# EAGLE design ideaboardv1b-new (EAGLE 7.6.0)
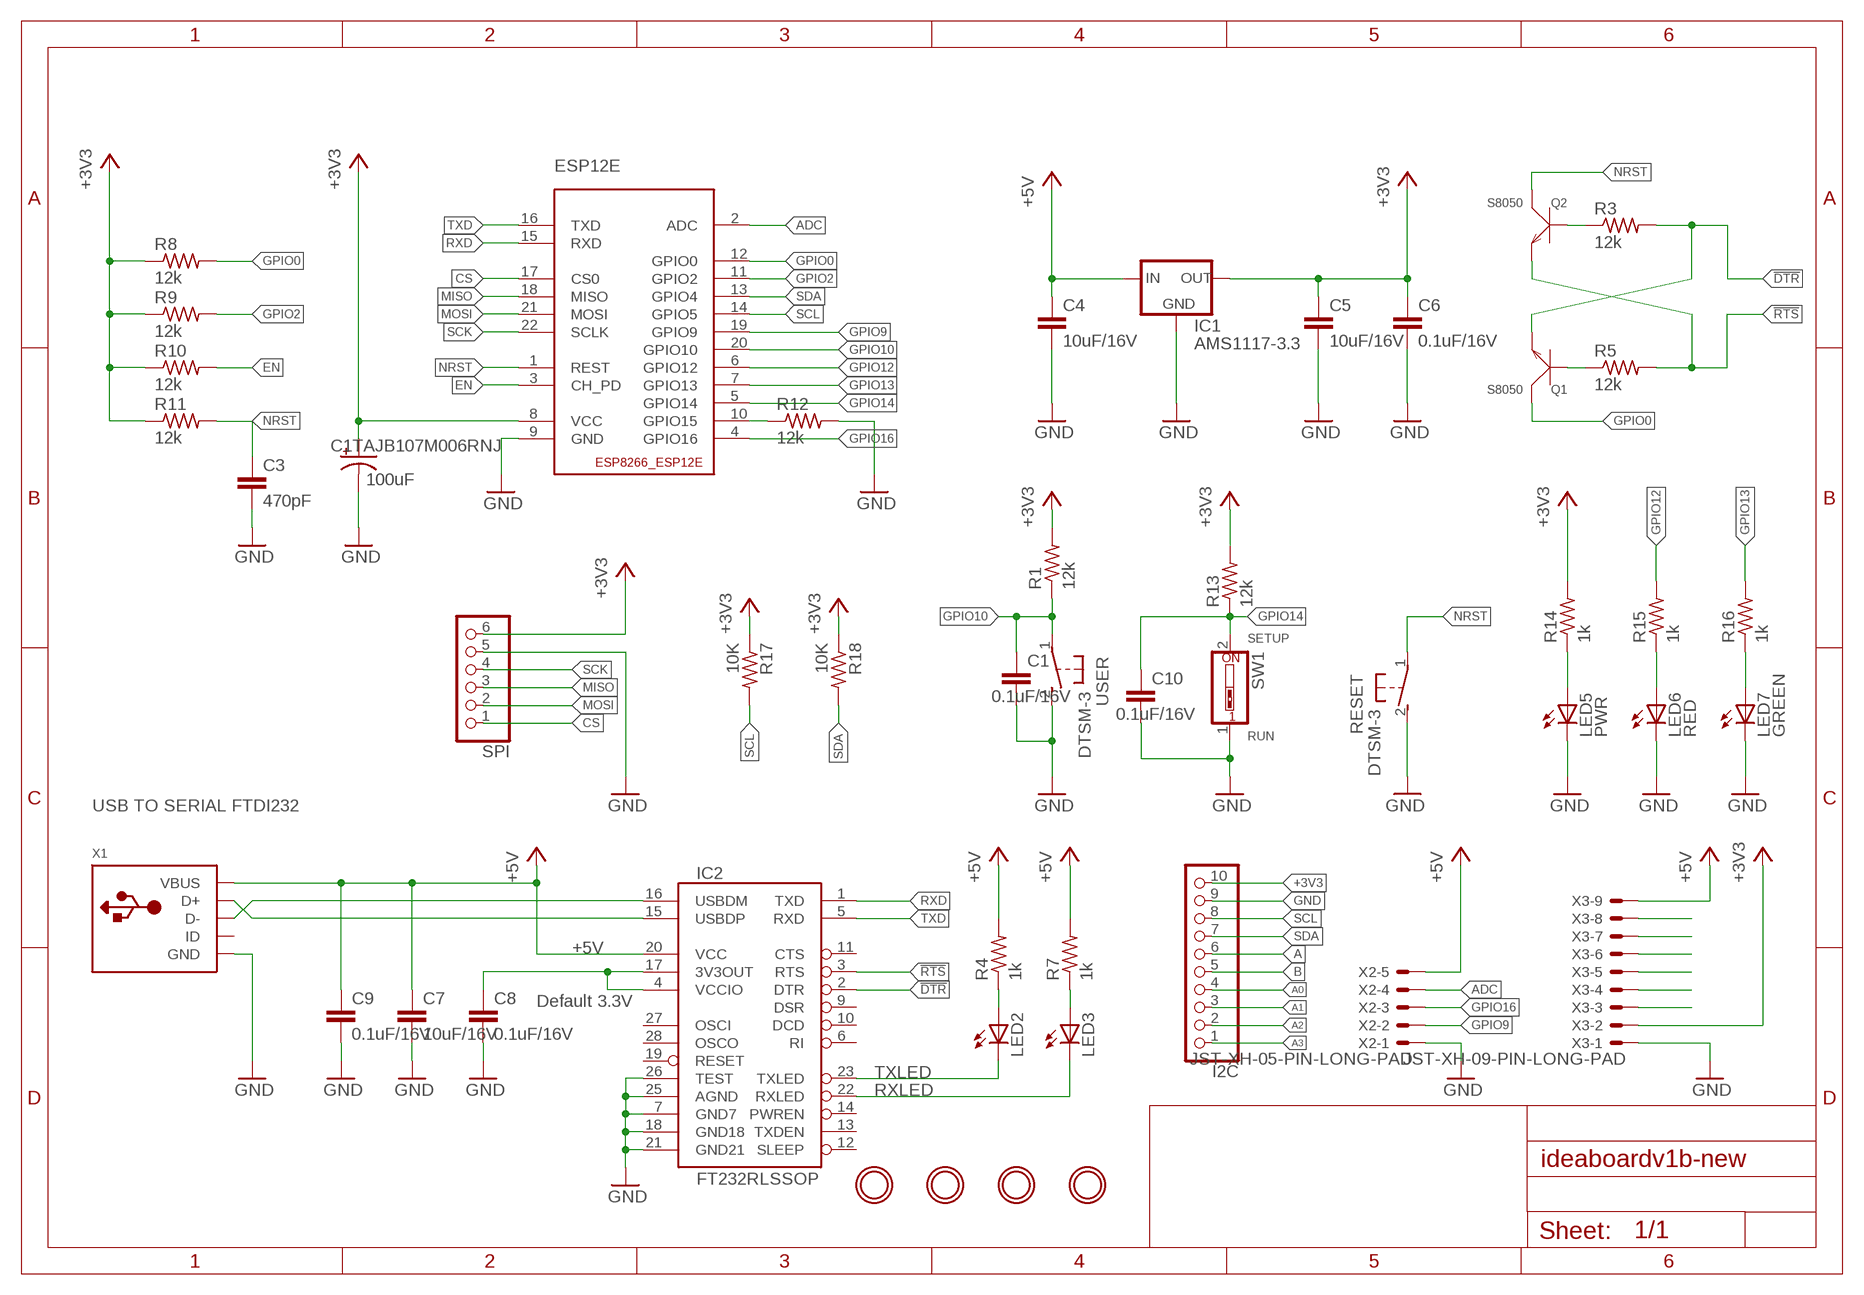
[diagram p0: schematic, sheet 1]

## Parts
C1  0.1uF/16V  C-EUC0805K  [C0805K]
C1TAJB107M006RNJ  100uF  CPOL-USA/3216-18R  [A/3216-18R]
C3  470pF  C-EUC0805K  [C0805K]
C4  10uF/16V  C-EUC0805K  [C0805K]
C5  10uF/16V  C-EUC0805K  [C0805K]
C6  0.1uF/16V  C-EUC0805K  [C0805K]
C7  10uF/16V  C-EUC0805K  [C0805K]
C8  0.1uF/16V  C-EUC0805K  [C0805K]
C9  0.1uF/16V  C-EUC0805K  [C0805K]
C10  0.1uF/16V  C-EUC0805K  [C0805K]
ESP12E  ESP8266-12EESP8266-ESP12E  [ESP8266-ESP12E]
I2C  PINHD-1X10  [1X10]
IC1  AMS1117-3.3  LM1117  [SOT223]
IC2  FT232RLSSOP  [SSOP28DB]
LED2  LEDCHIP-LED0805  [CHIP-LED0805]
LED3  LEDCHIP-LED0805  [CHIP-LED0805]
LED5  PWR  LEDCHIP-LED0805  [CHIP-LED0805]
LED6  RED  LEDCHIP-LED0805  [CHIP-LED0805]
LED7  GREEN  LEDCHIP-LED0805  [CHIP-LED0805]
Q1  S8050  SMD-TRANSISTORS-NPN-25V-500MW(SOT-23)  [SOT-23]
Q2  S8050  SMD-TRANSISTORS-NPN-25V-500MW(SOT-23)  [SOT-23]
R1  12k  R-US_M0805  [M0805]
R3  12k  R-US_M0805  [M0805]
R4  1k  R-US_M0805  [M0805]
R5  12k  R-US_M0805  [M0805]
R7  1k  R-US_M0805  [M0805]
R8  12k  R-US_M0805  [M0805]
R9  12k  R-US_M0805  [M0805]
R10  12k  R-US_M0805  [M0805]
R11  12k  R-US_M0805  [M0805]
R12  12k  R-US_M0805  [M0805]
R13  12k  R-US_M0805  [M0805]
R14  1k  R-US_M0805  [M0805]
R15  1k  R-US_M0805  [M0805]
R16  1k  R-US_M0805  [M0805]
R17  10K  R-US_M0805  [M0805]
R18  10K  R-US_M0805  [M0805]
RESET  DTSM-3  [DTSM-3]
SPI  PINHD-1X6  [1X06]
SW1  SW_DIP-1  [EDG-01]
U$1  MOUNTINGHOLE2.0  [MOUNTINGHOLE_2.0_PLATED]
U$2  MOUNTINGHOLE2.0  [MOUNTINGHOLE_2.0_PLATED]
U$3  MOUNTINGHOLE2.0  [MOUNTINGHOLE_2.0_PLATED]
U$4  MOUNTINGHOLE2.0  [MOUNTINGHOLE_2.0_PLATED]
USER  DTSM-3  [DTSM-3]
X1  USB_MICRO_20329_V2  [4UCONN_20329_V2]
X2  JST-XH-05-PIN-LONG-PAD  [JST-XH-05-PACKAGE-LONG-PAD]
X3  JST-XH-09-PIN-LONG-PAD  [JST-XH-09-PACKAGE-LONG-PAD]

## Nets
!DTR: IC2.2(DTR) Q1.2(E) R3.2
!RTS: IC2.3(RTS) Q2.2(E) R5.2
+3V3: C1TAJB107M006RNJ.+ C5.1 C6.1 ESP12E.8(VCC) I2C.10 IC1.2(OUT) R1.2 R8.1 R9.1 R10.1 R11.1 R13.2 R14.2 R17.1 R18.1 SPI.6 X3.2
+5V: C4.1 C7.1 C9.1 IC1.3(IN) IC2.20(VCC) R4.2 R7.2 X1.VBUS X2.5 X3.9
A: I2C.6 X3.3
A0: I2C.4 X3.5
A1: I2C.3 X3.6
A2: I2C.2 X3.7
A3: I2C.1 X3.8
ADC: ESP12E.2(ADC) X2.4
B: I2C.5 X3.4
CS: ESP12E.17(CS0) SPI.1
EN: ESP12E.3(CH_PD) R10.2
GND: C1.2 C1TAJB107M006RNJ.- C3.2 C4.2 C5.2 C6.2 C7.2 C8.2 C9.2 C10.2 ESP12E.9(GND) I2C.9 IC1.1(GND) IC2.7(GND7) IC2.18(GND18) IC2.21(GND21) IC2.25(AGND) IC2.26(TEST) LED5.C LED6.C LED7.C R12.2 RESET.2 SPI.5 SW1.1 USER.2 X1.BASE@1(GND) X1.BASE@2(GND) X1.GND X1.SPRT@1(GND) X1.SPRT@2(GND) X1.SPRT@3(GND) X1.SPRT@4(GND) X2.1 X3.1
GPIO0: ESP12E.12(GPIO0) Q1.3(C) R8.2
GPIO2: ESP12E.11(GPIO2) R9.2
GPIO9: ESP12E.19(GPIO9) X2.2
GPIO10: C1.1 ESP12E.20(GPIO10) R1.1 USER.1
GPIO12: ESP12E.6(GPIO12) R15.2
GPIO13: ESP12E.7(GPIO13) R16.2
GPIO14: C10.1 ESP12E.5(GPIO14) R13.1 SW1.2
GPIO16: ESP12E.4(GPIO16) X2.3
MISO: ESP12E.18(MISO) SPI.3
MOSI: ESP12E.21(MOSI) SPI.2
N$1: Q2.1(B) R3.1
N$2: Q1.1(B) R5.1
N$3: ESP12E.10(GPIO15) R12.1
N$5: C8.1 IC2.4(VCCIO) IC2.17(3V3OUT)
N$8: LED5.A R14.1
N$9: LED2.A R4.1
N$10: LED6.A R15.1
N$11: LED3.A R7.1
N$12: LED7.A R16.1
NRST: C3.1 ESP12E.1(REST) Q2.3(C) R11.2 RESET.1
RXD: ESP12E.15(RXD) IC2.1(TXD)
RXLED: IC2.22(RXLED) LED3.C
SCK: ESP12E.22(SCLK) SPI.4
SCL: ESP12E.14(GPIO5) I2C.8 R17.2
SDA: ESP12E.13(GPIO4) I2C.7 R18.2
TXD: ESP12E.16(TXD) IC2.5(RXD)
TXLED: IC2.23(TXLED) LED2.C
USB_D+: IC2.15(USBDP) X1.D+
USB_D-: IC2.16(USBDM) X1.D-
Unconnected: IC2.6(RI) IC2.9(DSR) IC2.10(DCD) IC2.11(CTS) IC2.12(SLEEP) IC2.13(TXDEN) IC2.14(PWREN) IC2.19(RESET) IC2.27(OSCI) IC2.28(OSCO) X1.ID

## Notes on the sheet
- SETUP
- RUN
- USB TO SERIAL FTDI232
- Default 3.3V

## Library data of the parts
C1 C3-C10 = rcl:C-EU: CAPACITOR, European symbol
C1TAJB107M006RNJ = rcl:CPOL-US: POLARIZED CAPACITOR, American symbol
ESP12E = ESP8266-ESP12E:ESP8266-12E: ESP8266-12E with additional I/O and GPIO04/05 corrected The author cannot warrant that this library is free from error or will meet your specific requirements. Created by PuceBaboon.com. Komagane, Nagano, JAPAN
I2C = pinhead:PINHD-1X10: PIN HEADER
IC1 = v-reg-3:LM1117
IC2 = FTDI Basic-v21-5V:FT232RL: USB UART FT232RL 4th Generation USB UART (USB <-> Serial) Controller. Spark Fun Electronics SKU : COM-00650
LED2 LED3 LED5-LED7 = led:LED: LED OSRAM: - CHIPLED LG R971, LG N971, LY N971, LG Q971, LY Q971, LO R971, LY R971 LH N974, LH R974 LS Q976, LO Q976, LY Q976 LO Q996 - Hyper CHIPLED LW Q18S LB Q993, LB Q99A, LB R99A - SideLED LS A670, LO A670, LY A670, LG A670, LP A670 LB A673, LV A673, LT A673, LW A673 LH A674 LY A675 LS A676, LA A676, LO A676, LY A676, LW A676 LS A679, LY A679, LG A679 - Hyper Micro SIDELED® LS Y876, LA Y876, LO Y876, LY Y876 LT Y87S - SmartLED LW L88C, LW L88S LB L89C, LB L89S, LG L890 LS L89K, LO L89K, LY L89K LS L896, LA L896, LO L896, LY L896 - TOPLED LS T670, LO T670, LY T670, LG T670, LP T670 LSG T670, LSP T670, LSY T670, LOP T670, LYG T670 LG T671, LOG T671, LSG T671 LB T673, LV T673, LT T673, LW T673 LH T674 LS T676, LA T676, LO T676, LY T676, LB T676, LH T676, LSB T676, LW T676 LB T67C, LV T67C, LT T67C, LS T67K, LO T67K, LY T67K, LW E67C LS E67B, LA E67B, LO E67B, LY E67B, LB E67C, LV E67C, LT E67C LW T67C LS T679, LY T679, LG T679 LS T770, LO T770, LY T770, LG T770, LP T770 LB T773, LV T773, LT T773, LW T773 LH T774 LS E675, LA E675, LY E675, LS T675 LS T776, LA T776, LO T776, LY T776, LB T776 LHGB T686 LT T68C, LB T68C - Hyper Mini TOPLED® LB M676 - Mini TOPLED Santana® LG M470 LS M47K, LO M47K, LY M47K Source: http://www.osram.convergy.de LUXEON: - LUMILED® LXK2-PW12-R00, LXK2-PW12-S00, LXK2-PW14-U00, LXK2-PW14-V00 LXK2-PM12-R00, LXK2-PM12-S00, LXK2-PM14-U00 LXK2-PE12-Q00, LXK2-PE12-R00, LXK2-PE12-S00, LXK2-PE14-T00, LXK2-PE14-U00 LXK2-PB12-K00, LXK2-PB12-L00, LXK2-PB12-M00, LXK2-PB14-N00, LXK2-PB14-P00, LXK2-PB14-Q00 LXK2-PR12-L00, LXK2-PR12-M00, LXK2-PR14-Q00, LXK2-PR14-R00 LXK2-PD12-Q00, LXK2-PD12-R00, LXK2-PD12-S00 LXK2-PH12-R00, LXK2-PH12-S00 LXK2-PL12-P00, LXK2-PL12-Q00, LXK2-PL12-R00 Source: www.luxeon.com KINGBRIGHT: KA-3528ASYC Source: www.kingbright.com
Q1 Q2 = s8050-transistor:SMD-TRANSISTORS-NPN-25V-500MW(SOT-23): 305010017; AVAILABILITY: Unavailable; DESCRIPTION: SMD Transistors NPN 25V-500mW%3B; MF: JCET; MP: S8050; PACKAGE: SOT-23-3 JCET; PRICE: None
R1 R3-R5 R7-R18 = rcl:R-US_: RESISTOR, American symbol
RESET USER = switch-tact:DTSM-3
SPI = pinhead:PINHD-1X6: PIN HEADER
SW1 = special:SW_DIP-1: DIP SWITCH
U$1-U$4 = Adafruit SIM808 Breakout:MOUNTINGHOLE: Mounting Hole For #2 screws (0.086"/2.18mm width, 0.094"/2.4mm hole) use 2.5mm; BOM: EXCLUDE
X1 = Adafruit SIM808 Breakout:USB: USB Connectors USBMINIB - Surface Mount Female Mini-B USB Connector 4UConnector: 06564
X2 = Rembrandt Electronics - JST XH Connectors v1-0:JST-XH-05-PIN: JST XH Connector 2 Pin Wire to board connector. Pitch: 2,54 mm, (0.100") Number of pins: 5 Created by Rembrandt Electronics www.rembrandtelectronics.com
X3 = Rembrandt Electronics - JST XH Connectors v1-0:JST-XH-09-PIN: JST XH Connector 2 Pin Wire to board connector. Pitch: 2,54 mm, (0.100") Number of pins: 9 Created by Rembrandt Electronics www.rembrandtelectronics.com

## Net classes
0 default: width 0.203 mm, drill 0.356 mm, clearance 0.203 mm
1 power: width 0.305 mm, drill 0.356 mm, clearance 0.203 mm

## Board
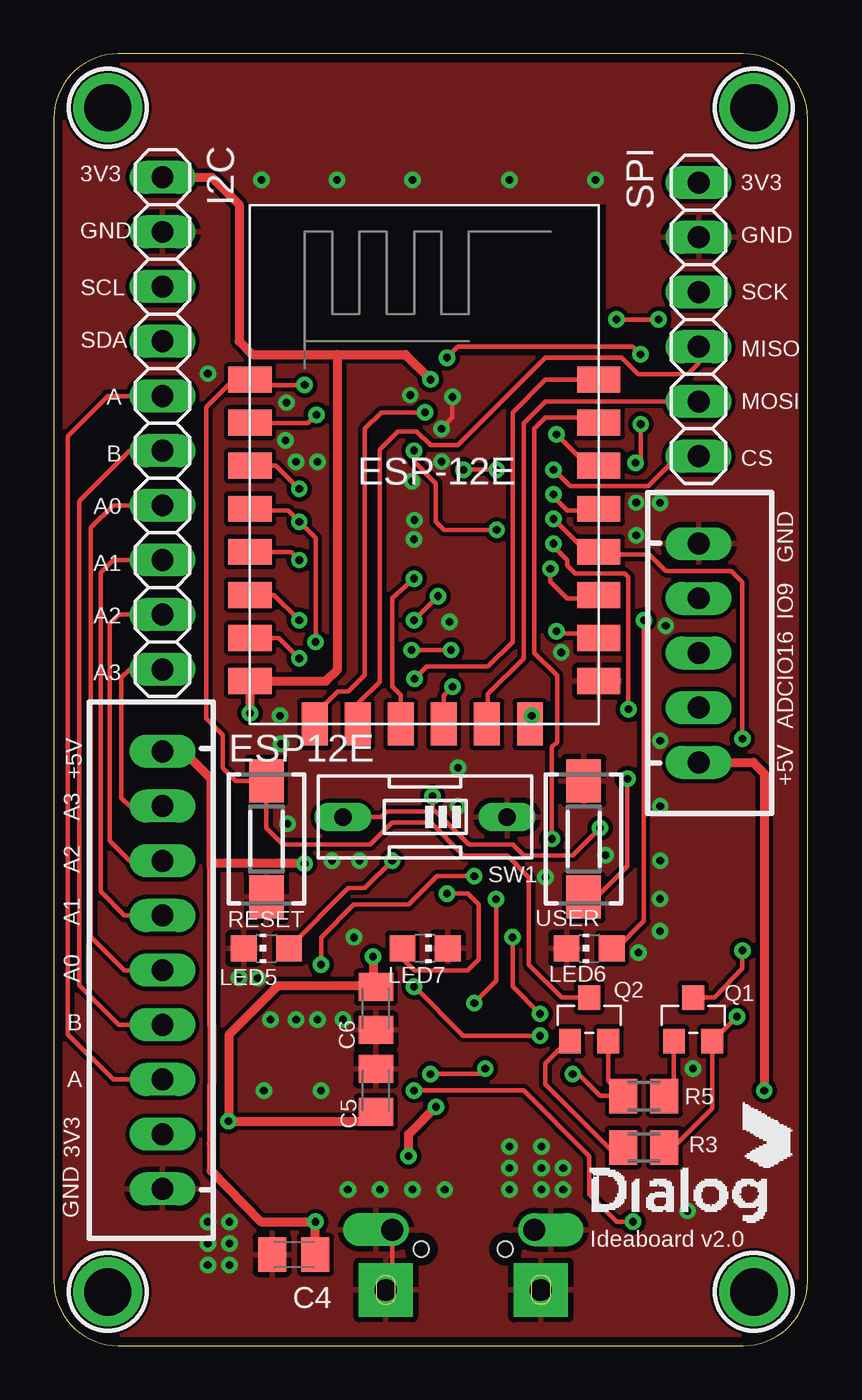
[diagram p1: board, top side]
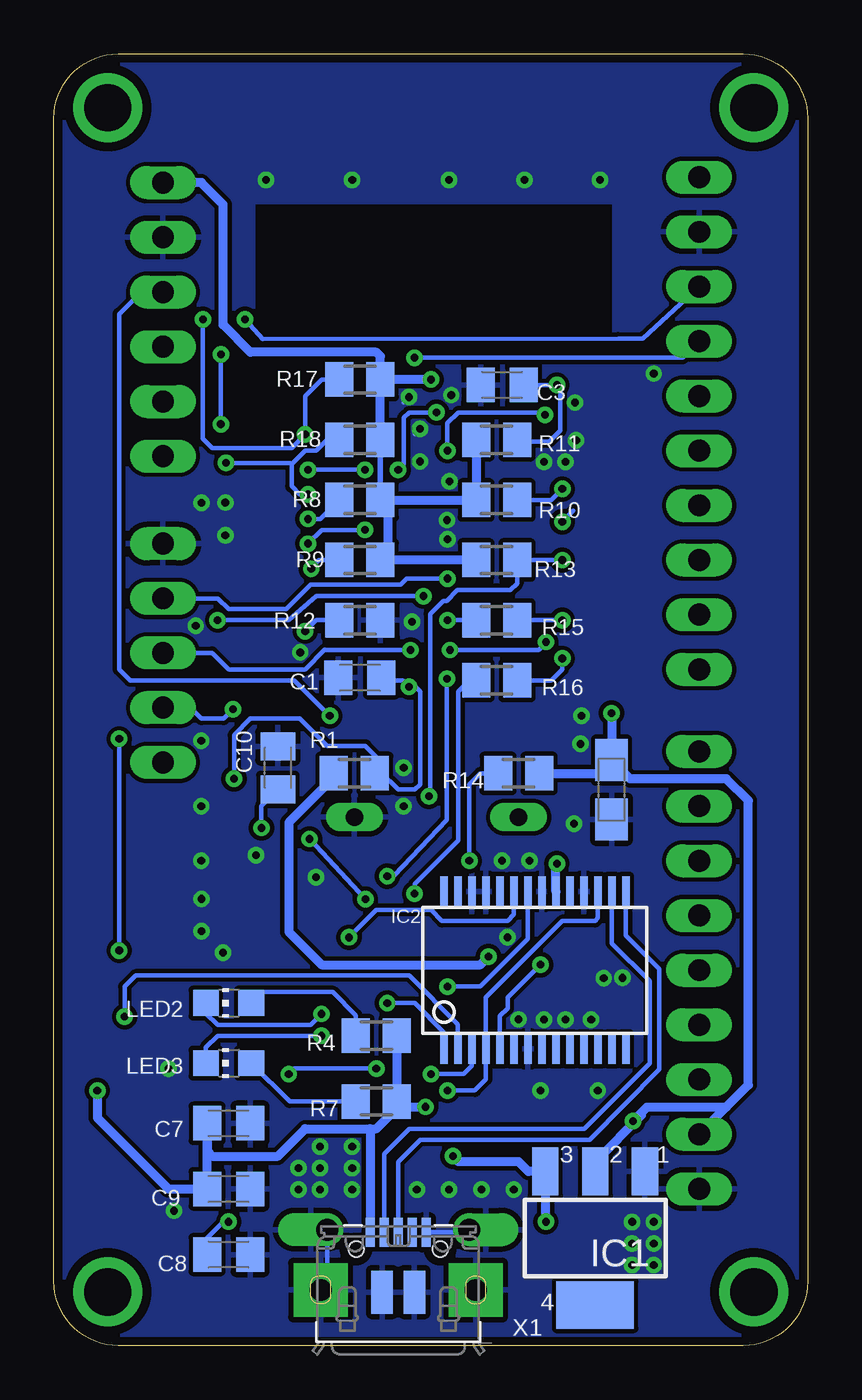
[diagram p2: board, bottom side, seen from below]

Size 35 x 60 mm. Coordinates in mm from the lower left corner, seen from the top.
Outline: 3,0 32,0 arc90 35,3 35,57 arc90 32,60 3,60 arc90 0,57 0,3 arc90 3,0
Copper layers (1*16): Top 0.035mm / dielectric 1.5mm / Bottom 0.035mm
Design rules "default *": minimum track width 8mil, minimum drill 14mil, track to track 6mil, track to pad 6mil, pad to pad 6mil, via to via 6mil, smd to smd 6mil, copper to edge 16mil, drill to drill 8mil, minimum pad ring 10mil, minimum via ring 8mil, stop-mask expansion 4mil, vias tented up to drill 0mil, thermal gap 10mil

### Footprints (pad centres in the part's own frame; a part is rotated, then mirrored left to right if it is on the bottom)
C0805K = smd 1.3 x 1.6: 1 -1,0; 2 1,0
A/3216-18R = smd 1.95 x 1.5: + 1.375,0; - -1.375,0
ESP8266-ESP12E = smd 2 x 1.2: 1 -7.62,5.84; 2 -7.62,3.84; 3 -7.62,1.84; 4 -7.62,-0.16; 5 -7.62,-2.16; 6 -7.62,-4.16; 7 -7.62,-6.16; 8 -7.62,-8.16; 9 8.58,-8.16; 10 8.58,-6.16; 11 8.58,-4.16; 12 8.58,-2.16; 13 8.58,-0.16; 14 8.58,1.84; 15 8.58,3.84; 16 8.58,5.84 | smd 1.2 x 2: 17 -4.62,-10.16; 18 -2.62,-10.16; 19 -0.62,-10.16; 20 1.38,-10.16; 21 3.38,-10.16; 22 5.38,-10.16
1X10 = drill 1.016 long: 1 -11.43,0; 2 -8.89,0; 3 -6.35,0; 4 -3.81,0; 5 -1.27,0; 6 1.27,0; 7 3.81,0; 8 6.35,0; 9 8.89,0; 10 11.43,0
SOT223 = smd 1.219 x 2.235: 1 -2.311,-3.099; 2 0,-3.099; 3 2.311,-3.099 | smd 3.6 x 2.2: 4 0,3.099
SSOP28DB = smd 0.348 x 1.397: 1 -4.225,-3.656; 2 -3.575,-3.656; 3 -2.925,-3.656; 4 -2.275,-3.656; 5 -1.625,-3.656; 6 -0.975,-3.656; 7 -0.325,-3.656; 8 0.325,-3.656; 9 0.975,-3.656; 10 1.625,-3.656; 11 2.275,-3.656; 12 2.925,-3.656; 13 3.575,-3.656; 14 4.225,-3.656; 15 4.225,3.656; 16 3.575,3.656; 17 2.925,3.656; 18 2.275,3.656; 19 1.625,3.656; 20 0.975,3.656; 21 0.325,3.656; 22 -0.325,3.656; 23 -0.975,3.656; 24 -1.625,3.656; 25 -2.275,3.656; 26 -2.925,3.656; 27 -3.575,3.656; 28 -4.225,3.656
CHIP-LED0805 = smd 1.2 x 1.2: A 0,-1.05; C 0,1.05
SOT-23 = smd 1.016 x 1.143: 1 -0.889,-1.016; 2 0.889,-1.016; 3 0,1.016
M0805 = smd 1.3 x 1.6: 1 -0.95,0; 2 0.95,0
DTSM-3 = smd 2 x 1.6: 1 -2.7,0; 2 2.7,0
1X06 = drill 1.016 long: 1 -6.35,0; 2 -3.81,0; 3 -1.27,0; 4 1.27,0; 5 3.81,0; 6 6.35,0
EDG-01 = drill 0.813 long: 1 0,-3.81; 2 0,3.81
MOUNTINGHOLE_2.0_PLATED = drill 2.2 pad 3: P$1 0,0
4UCONN_20329_V2 = smd 1 x 2: BASE@1 -0.75,-2; BASE@2 0.75,-2 | smd 0.4 x 1.35: D+ 0,0.775; D- -0.65,0.775; GND 1.3,0.775; ID 0.65,0.775; VBUS -1.3,0.775 | drill 1.016 pad 1.454 offset: SPRT@1 -3.3,0.9; SPRT@2 3.3,0.9 | drill 1.016 pad 2.5 square: SPRT@3 -3.6,-1.9; SPRT@4 3.6,-1.9 | hole 0.7: -1.95,0; 1.95,0
JST-XH-05-PACKAGE-LONG-PAD = drill 1.016 long: 1 -5.08,0; 2 -2.54,0; 3 0,0; 4 2.54,0; 5 5.08,0
JST-XH-09-PACKAGE-LONG-PAD = drill 1.016 long: 1 -10.16,0; 2 -7.62,0; 3 -5.08,0; 4 -2.54,0; 5 0,0; 6 2.54,0; 7 5.08,0; 8 7.62,0; 9 10.16,0

### Placement (x,y rotation side)
C1  20.79,31.03 180 bottom
C1TAJB107M006RNJ  9.11,25.82 90 bottom
C3  14.19,44.62 180 bottom
C4  11.14,4.23 180 top
C5  14.95,11.85 90 top
C6  14.95,15.66 270 top
C7  26.89,10.33 0 bottom
C8  26.89,4.23 0 bottom
C9  26.89,7.28 0 bottom
C10  24.6,26.84 90 bottom
ESP12E  16.73,39.03 0 top
I2C  5.04,42.84 90 top
IC1  9.87,4.99 180 bottom
IC2  12.66,17.44 0 bottom
LED2  26.89,15.92 90 bottom
LED3  26.89,13.12 90 bottom
LED5  9.87,18.46 90 top
LED6  24.85,18.46 90 top
LED7  17.23,18.46 270 top
Q1  29.68,15.15 0 top
Q2  24.85,15.15 0 top
R1  21.04,26.58 180 bottom
R3  27.39,9.21 0 top
R4  20.03,14.39 0 bottom
R5  27.39,11.6 180 top
R7  20.03,11.34 0 bottom
R8  20.79,39.28 180 bottom
R9  20.79,36.49 180 bottom
R10  14.44,39.28 0 bottom
R11  14.44,42.08 0 bottom
R12  20.79,33.7 0 bottom
R13  14.44,36.49 180 bottom
R14  13.42,26.58 0 bottom
R15  14.44,33.7 0 bottom
R16  14.44,30.9 0 bottom
R17  20.79,44.87 180 bottom
R18  20.79,42.08 180 bottom
RESET  9.87,23.54 270 top
SPI  29.93,47.67 90 top
SW1  17.23,24.55 90 top
U$1  2.5,2.5 0 top
U$2  32.5,2.5 0 top
U$3  2.5,57.5 0 top
U$4  32.5,57.5 0 top
USER  24.6,23.54 90 top
X1  19.01,4.49 0 bottom
X2  29.93,32.17 270 top
X3  5.04,17.44 90 top

### Tracks (layer width: path | path; a pad name or v marks a point on that pad's centre or on a via)
!DTR  (via drill 0.36 pad 0.76)
  Top 0.203: v31.71,15.28 Q1.2 30.57,11.03 28.75,9.21 R3.2
  Bottom 0.203: IC2.2 16.24,14.92 18.5,17.19 31.2,17.19 31.71,16.68 v31.71,15.28
!RTS  (via drill 0.36 pad 0.76)
  Top 0.203: Q2.2 25.74,12.3 R5.2 25.36,11.6 24.35,12.61 v24.09,12.61 | v17.49,12.61 19.77,12.61 v20.03,12.87
  Bottom 0.203: IC2.3 15.59,12.99 15.96,12.61 v17.49,12.61 | v20.03,12.87 23.84,12.87 v24.09,12.61
+3V3  (via drill 0.36 pad 0.76)
  Top 0.203: 14.82,16.79 14.88,16.73 C6.1
  Top 0.406: 14.88,16.73 10.43,16.73 8.13,14.43 8.13,13.66 v8.12,10.43 14.53,10.43 C5.1 | I2C.10 7.33,54.27 8.6,53 8.6,46.65 9.21,46.04 13.17,46.04 | 13.17,46.04 16.32,46.04 v17.49,44.87 | v9.11,29.38 ESP12E.8 12.63,30.87 13.17,31.41 13.17,46.04 | v14.82,18.08 14.82,16.79
  Bottom 0.203: R10.1 R11.1 | 15.39,39.35 15.46,39.28 R8.1 | IC1.2 9.87,8.55 | v8.12,10.43 7.71,10.71 | 21.74,26.4 21.99,26.4
  Bottom 0.254: R18.1 R8.1
  Bottom 0.406: v17.49,44.87 R17.1 | R17.1 19.84,45.95 20.03,46.14 25.87,46.14 27.14,47.41 27.14,53 28.16,54.02 SPI.6 | v9.11,29.38 C1TAJB107M006RNJ.+ | R14.2 9.72,26.58 C1TAJB107M006RNJ.+ | R11.1 15.39,39.35 | R1.2 21.74,26.4 | 9.87,8.55 7.71,10.71 | 3.77,11.09 7.46,11.09 v8.12,10.43 | 3.77,11.09 2.76,12.11 2.76,25.31 3.77,26.33 8.24,26.33 C1TAJB107M006RNJ.+ | 3.77,11.09 X3.2 | R13.2 R9.1 19.51,36.82 19.51,38.81 19.84,39.14 R8.1 15.71,39.28 15.46,39.03 | R18.1 R17.1 | 21.99,26.4 24.09,24.3 24.09,19.22 22.57,17.69 15.2,17.69 v14.82,18.08
+5V  (via drill 0.36 pad 0.76)
  Top 0.203: 7.43,22.39 7.3,22.27 | 12.14,5.74 v12.15,5.76
  Top 0.406: v11.65,22.39 7.43,22.39 | C4.1 12.14,5.74 | v16.47,8.8 16.47,9.82 v17.74,11.09 | v12.15,5.76 9.61,5.76 7.3,8.12 7.3,9.39 7.33,14.9 7.33,22.24 7.3,22.27 7.3,26.33 6.03,27.6 X3.9 | X2.5 32.47,27.09 32.98,26.58 v32.98,11.85
  Bottom 0.203: 19.27,10.84 19.27,11.16 R7.2 R4.2 19.08,11.41 19.01,11.34 | 19.08,11.16 19.01,11.09 | 11.69,22.35 v11.65,22.39 | 12.15,8.07 IC1.3
  Bottom 0.406: 19.27,10.84 20.03,10.07 20.31,10.07 | 20.31,10.07 23.33,10.07 24.6,8.8 27.65,8.8 27.89,9.04 C7.1 C9.1 29.68,7.28 32.98,10.58 v32.98,11.85 | R4.2 19.08,11.16 | 19.01,11.09 v17.74,11.09 | IC2.20 11.69,22.35 | 20.31,10.07 X1.VBUS | v12.15,5.76 12.15,8.07 | IC1.3 12.97,8.09 13.42,8.55 16.22,8.55 v16.47,8.8
A
  Top 0.203: I2C.6 2.5,44.11 0.65,42.26 0.65,14.47 2.76,12.36 X3.3
A0
  Top 0.203: I2C.4 2.76,39.03 1.71,37.99 1.71,18.99 3.26,17.44 X3.5
A1
  Top 0.203: I2C.3 2.76,36.49 2.17,35.91 2.17,21.1 3.26,19.98 X3.6
A2
  Top 0.203: I2C.2 3.01,33.95 2.6,33.54 2.6,23.43 3.52,22.52 X3.7
A3
  Top 0.203: X3.8 3.52,25.06 3.14,25.44 3.14,31.03 3.52,31.41 I2C.1
ADC  (via drill 0.36 pad 0.76)
  Top 0.203: ESP12E.2 9.14,42.84 11.79,42.84 v12.19,43.24 | v20.56,37.89 18.12,37.89 17.74,38.27 17.74,40.05 16.73,41.06 v16.73,41.57 | v23.2,37.25 23.2,37.12 23.84,36.49 23.84,36.24 24.22,35.85 26.51,35.85 26.67,35.69 26.67,29.57 v26.68,29.56
  Bottom 0.203: X2.4 28.66,29.63 28.16,29.12 27.11,29.12 v26.68,29.56 | v20.56,37.89 22.57,37.89 v23.2,37.25 | v16.73,41.57 16.73,42.84 16.22,43.35 12.3,43.35 v12.19,43.24
B
  Top 0.203: I2C.5 3.52,41.57 1.18,39.23 1.18,16.73 3.01,14.9 X3.4
CS  (via drill 0.36 pad 0.76)
  Top 0.203: SPI.1 29,41.32 27.6,39.92 23.97,39.92 v23.2,40.68 | ESP12E.17 12.11,29.33 13.17,30.39 13.68,30.39 14.44,31.16 14.44,42.59 15.2,43.35 v17.23,43.35 | v20.56,40.68 v19.01,40.68
  Bottom 0.203: v17.23,43.35 18.5,43.35 18.76,43.09 18.76,40.93 v19.01,40.68 | v23.2,40.68 v20.56,40.68
EN  (via drill 0.36 pad 0.76)
  Top 0.203: ESP12E.3 10.31,40.87 v11.39,39.79
  Bottom 0.203: v11.39,39.79 11.9,39.28 R10.2
GND  (via drill 0.36 pad 0.76)
  Top 0.203: X1.SPRT@2 15.71,2.89 X1.SPRT@4 | v18.5,44.06 18.5,43.09 v18,42.59
  Bottom 0.203: X1.GND 15.84,5.26 X1.SPRT@2 | X1.SPRT@1 22.31,2.89 X1.SPRT@3 | 18.76,43.8 v18.5,44.06 | v18,42.59 18.25,42.33
  other vias: 13.42,15.15 12.92,22.52 14.19,22.52 13.93,18.96 16.62,40.15 18,41.06 18.38,33.62 23.56,32.2 12.41,11.85 27.04,39.16 27.04,37.64 28.15,39.15 22.82,21.76 28.16,22.52 28.16,25.06 28.16,28.1 8.6,17.08 29.43,6.26 29.68,12.87 28.41,33.44 18.76,25.06 16.73,37.46 25.62,22.77 18.76,26.84 10.5,29.25 9.65,54.15 25.15,54.15 21.15,54.15 16.65,54.15 13.15,54.15 7.15,45.15 10.8,43.8 10.75,42.05 12.25,41.05 11.25,41.05 16.55,44.15 16.75,38.35 10.55,27.95 10.85,24.25 28.15,20.75 28.15,19.25 27.15,18.25 13.65,7.25 15.15,7.25 16.65,7.25 18.15,7.25 21.15,9.25 22.65,9.25 23.65,8.25 21.15,8.25 21.15,7.25 22.65,7.25 22.65,8.25 23.65,7.25 7.15,3.75 8.15,3.75 8.15,4.75 8.15,5.75 7.15,5.75 7.15,4.75 9.47,17.07 12.25,15.15 11.25,15.15 10.05,15.15 9.75,11.85
  pour Top: 0.02,60 35,60 35,0 0,0
  pour Bottom: 0.02,60 35,60 35,0 0,0
GPIO0  (via drill 0.36 pad 0.76)
  Top 0.203: Q1.3 30.7,16.17 31.97,17.52 v31.97,18.35 | v31.97,28.18 31.97,35.47 31.46,35.98 28.41,35.98 27.65,36.74 25.18,36.74 ESP12E.12 24.92,37.25 24.35,37.25 v23.2,38.39
  Bottom 0.203: 22.06,39.28 R8.2 22.63,38.39 v23.2,38.39 | v31.97,28.18 v31.97,18.35
GPIO2  (via drill 0.36 pad 0.76)
  Top 0.203: ESP12E.11 25.15,34.71 23.84,34.71 23.05,35.5 v23.05,36.08
  Bottom 0.203: R9.2 22.7,36.49 23.05,36.13 v23.05,36.08
GPIO9  (via drill 0.36 pad 0.76)
  Top 0.203: ESP12E.19 16.11,30.22 15.72,30.61 15.72,34.73 v16.73,35.63
  Bottom 0.203: X2.2 27.39,34.71 26.89,34.2 24.22,34.2 23.08,35.35 18.89,35.35 18.61,35.63 v16.73,35.63
GPIO10  (via drill 0.36 pad 0.76)
  Top 0.203: USER.1 25.2,20.84 26.63,22.27 v26.63,26.33 | ESP12E.20 18.11,30.2 v18.5,30.6
  Bottom 0.203: C1.1 19.66,30.9 18.81,30.9 v18.5,30.6 18.2,30.6 18,30.39 18,26.08 18.25,25.82 19.01,25.82 19.84,26.65 | R1.1 19.84,26.65 | v26.63,26.33 26.63,28.36 25.87,29.12 23.58,29.12 22.31,27.85 20.54,27.85 19.84,27.16 19.84,26.65
GPIO12  (via drill 0.36 pad 0.76)
  Top 0.203: ESP12E.6 10.22,34.87 v11.39,33.7
  Bottom 0.203: v11.39,33.7 R15.2
GPIO13  (via drill 0.36 pad 0.76)
  Top 0.203: ESP12E.7 10.44,32.87 v11.39,31.92
  Bottom 0.203: v11.39,31.92 11.39,31.41 11.9,30.9 R16.2
GPIO14  (via drill 0.36 pad 0.76)
  Top 0.203: ESP12E.5 11.01,36.87 v11.39,36.49 | SW1.2 15.2,24.55 15.46,24.81 17.5,24.81 | 17.5,24.81 17.74,24.81 19.27,23.28 21.3,23.28 21.81,22.77 24.09,22.77 v25.36,24.04 | v17.59,25.51 17.59,24.89 17.5,24.81
  Bottom 0.203: v11.39,36.49 R13.1 13.49,35.41 13.81,35.09 16.27,35.09 16.76,34.59 16.92,34.59 17.53,33.98 17.53,25.58 v17.59,25.51 | v25.36,24.04 25.36,25.08 C10.1
GPIO16  (via drill 0.36 pad 0.76)
  Top 0.203: 8.85,38.78 9.01,38.78 ESP12E.4 9.2,38.78 10.88,38.78 v11.39,38.27 12.15,37.51 v12.15,32.68 | v16.61,32.31 v18.44,32.31
  Bottom 0.203: 10.88,38.78 v11.39,38.27 | X2.3 27.65,32.17 26.89,31.41 23.33,31.41 22.42,32.32 22.4,32.31 v18.44,32.31 | v16.61,32.31 12.5,32.31 12.15,32.65 v12.15,32.68
MISO
  Top 0.203: ESP12E.18 14.19,28.95 14.19,29.89 15.12,30.82 15.12,41.62 15.96,42.46 16.85,42.46 17.49,41.82 18.76,41.82 22.82,45.89 26.38,45.89 27.14,45.13 29.43,45.13 29.93,45.63 SPI.3
MOSI
  Top 0.203: SPI.2 22.82,43.86 21.81,42.84 21.81,31.92 20.16,30.27 20.16,28.92 ESP12E.21
N$1
  Top 0.203: Q2.1 23.84,14.14 22.82,13.12 22.82,12.13 25.81,9.14 26.38,9.14 R3.1
N$2
  Top 0.203: Q1.1 28.79,12.04 R5.1
N$3  (via drill 0.36 pad 0.76)
  Top 0.203: 25.12,32.68 ESP12E.10 24.74,32.87 24.54,33.07 23.45,33.07 v23.33,33.19
  Bottom 0.203: R12.1 22.82,33.7 v23.33,33.19
N$5  (via drill 0.36 pad 0.76)
  Top 0.203: v16.73,11.85 21.81,11.85 24.85,8.8 24.85,7.03 26.12,5.76 v26.89,5.76
  Bottom 0.203: v16.73,11.85 15.46,11.85 14.94,12.37 IC2.4 14.95,13.79 14.95,16.17 11.39,19.73 9.87,19.73 9.74,19.86 IC2.17 | v26.89,5.76 27.14,5.76 27.9,4.99 27.9,4.25 C8.1
N$8  (via drill 0.36 pad 0.76)
  Top 0.203: LED5.A 10.92,18.49 13.68,21.25 14.44,21.25 v15.71,22.52
  Bottom 0.203: R14.1 15.2,26.58 15.71,26.08 v15.71,22.52
N$9
  Bottom 0.203: R4.1 20.98,15.34 22.06,16.42 25.33,16.42 LED2.A
N$10  (via drill 0.36 pad 0.76)
  Top 0.203: LED6.A 26.12,18.46 27.39,19.73 v27.39,33.7 | v17.84,34.81 v16.73,33.7
  Bottom 0.203: v27.39,33.7 24.09,33.7 22.82,34.81 v17.84,34.81 | v16.73,33.7 R15.1
N$11
  Bottom 0.203: R7.1 24.06,11.34 LED3.A
N$12  (via drill 0.36 pad 0.76)
  Top 0.203: LED7.A 16.18,17.98 16.73,17.44 19.22,17.44 19.72,17.95 19.72,20.49 19.22,21 v18.25,21
  Bottom 0.203: R16.1 15.71,30.9 16.22,30.39 16.22,23.47 18.25,21.44 v18.25,21
NRST  (via drill 0.36 pad 0.76)
  Top 0.203: v11.65,44.62 9.36,44.62 ESP12E.1 8.34,44.87 7.07,43.6 7.07,29.12 7.84,28.36 7.84,26.84 8.44,26.24 RESET.1 9.87,24.04 10.63,23.28 14.69,23.28 15.71,24.3 17.49,24.3 19.01,22.77 21.04,22.77 22.06,21.76 22.06,17.69 23.58,16.17 Q2.3
  Bottom 0.203: v11.65,44.62 C3.1 11.62,44.62 11.5,44.5 11.5,42.5 12,42 13.41,42 R11.2 13.19,42.38
RXD  (via drill 0.36 pad 0.76)
  Top 0.203: ESP12E.15 24.82,42.87 24.6,43.09 22.82,43.09 22.31,42.59 22.31,32.17 23.37,31.12 23.37,28.04 23.13,27.8 v23.13,23.54 | v20.54,20.74 20.54,16.93 v19.52,15.92
  Bottom 0.203: IC2.1 16.89,14.55 18.25,15.92 v19.52,15.92 | v20.54,20.74 v23.13,23.54
RXLED  (via drill 0.36 pad 0.76)
  Top 0.203: v22.57,14.39 19.01,14.39 v16.73,16.68
  Bottom 0.203: LED3.C 27.94,13.85 27.39,14.39 v22.57,14.39 | v16.73,16.68 15.2,16.68 12.99,18.89 IC2.22
SCK  (via drill 0.36 pad 0.76)
  Top 0.203: 22.19,28.87 ESP12E.22 22.19,28.95 v22.19,29.25
  Bottom 0.203: SPI.4 30.95,48.94 31.97,47.92 31.97,31.41 31.46,30.9 23.84,30.9 v22.19,29.25
SCL  (via drill 0.36 pad 0.76)
  Top 0.203: v23.33,42.33 24.85,40.81 25.24,40.81 ESP12E.14 | v26.12,47.67 v28.08,47.67
  Bottom 0.203: R17.2 22.57,44.87 23.33,44.11 v23.33,42.33 23.96,41.7 27.65,41.7 28.08,42.13 v28.08,47.67 | v26.12,47.67 25.31,46.75 8.81,46.77 7.66,46.77 I2C.8
SDA  (via drill 0.36 pad 0.76)
  Top 0.203: ESP12E.13 25.21,38.78 23.84,38.78 23.2,39.41 v23.2,39.54 | v27.24,46.04 26.89,46.4 18.76,46.4 v18.25,45.89 | v27.25,42.8 27.25,41.25 v27,41
  Bottom 0.203: 23.97,40.93 23.33,41.57 22.82,41.57 22.31,42.08 R18.2 | 23.97,40.93 23.97,39.92 23.58,39.54 v23.2,39.54 | v18.25,45.89 5.8,45.89 I2C.7 | v27.24,46.04 27.24,42.96 v27.25,42.8 | v27,41 24.03,41 23.97,40.93
TXD  (via drill 0.36 pad 0.76)
  Top 0.203: ESP12E.16 22.82,44.87 21.3,43.35 21.3,32.68 20.16,31.54 17.31,31.54 v16.75,30.98 | v12.41,17.69 12.41,18.96 13.93,20.49 16.47,20.49 17.79,21.81 v19.52,21.81
  Bottom 0.203: v16.75,30.98 16.75,24.42 19.22,21.81 v19.52,21.81 | IC2.5 14.29,15.31 13.93,15.66 13.93,16.17 v12.41,17.69
TXLED  (via drill 0.36 pad 0.76)
  Top 0.203: v22.57,15.41 21.3,16.68 v21.3,18.96
  Bottom 0.203: LED2.C 27.94,15.44 27.39,14.9 23.08,14.9 v22.57,15.41 | IC2.23 13.64,20.02 13.93,19.73 16.98,19.73 17.49,20.23 20.03,20.23 v21.3,18.96
USB_D+
  Bottom 0.203: IC2.15 8.44,19.06 6.9,17.49 6.9,12.84 10.12,9.57 18,9.57 19.01,8.55 X1.D+
USB_D-
  Bottom 0.203: IC2.16 9.09,18.69 7.33,16.93 7.33,13.12 10.38,10.07 18.5,10.07 19.66,8.92 X1.D-

### Text on the board
tNames: 3V3 | 3V3 | GND | GND | SCL | SCK | SDA | MISO | A | MOSI | B | CS | A0 | A1 | GND | A2 | IO9 | A3 | IO16 | ADC | +5V | +5V | A3 | A2 | A1 | A0 | B | A | 3V3 | GND | Ideaboard v2.0